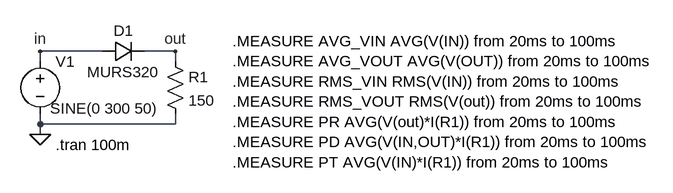
[diagram p0: schematic redressement simple.asc]
redressement simple.asc, the LTspice schematic file:
Version 4
SHEET 1 880 680
WIRE -80 160 -176 160
WIRE 32 160 -16 160
WIRE -176 176 -176 160
WIRE 32 176 32 160
WIRE -176 272 -176 256
WIRE 32 272 32 256
WIRE 32 272 -176 272
WIRE -176 288 -176 272
FLAG -176 288 0
FLAG -176 160 in
FLAG 32 160 out
SYMBOL voltage -176 160 R0
WINDOW 123 0 0 Left 0
WINDOW 39 0 0 Left 0
WINDOW 3 15 88 Left 0
SYMATTR InstName V1
SYMATTR Value SINE(0 300 50)
SYMBOL diode -80 176 R270
WINDOW 0 32 32 VTop 0
WINDOW 3 0 32 VBottom 0
SYMATTR InstName D1
SYMATTR Value MURS320
SYMBOL res 16 160 R0
SYMATTR InstName R1
SYMATTR Value 150
TEXT -152 304 Left 0 !.tran 100m
TEXT 120 144 Left 0 !.MEASURE AVG_VIN AVG(V(IN)) from 20ms to 100ms\n.MEASURE AVG_VOUT AVG(V(OUT)) from 20ms to 100ms\n.MEASURE RMS_VIN RMS(V(IN)) from 20ms to 100ms\n.MEASURE RMS_VOUT RMS(V(out)) from 20ms to 100ms\n.MEASURE PR AVG(V(out)*I(R1)) from 20ms to 100ms\n.MEASURE PD AVG(V(IN,OUT)*I(R1)) from 20ms to 100ms\n.MEASURE PT AVG(V(IN)*I(R1)) from 20ms to 100ms

The netlist it stands for:
* redressement simple.asc
V1 in 0 SINE(0 300 50)
D1 in out MURS320
R1 out 0 150
.model D D
.lib standard.dio
.tran 100m
.MEASURE AVG_VIN AVG(V(IN)) from 20ms to 100ms
.MEASURE AVG_VOUT AVG(V(OUT)) from 20ms to 100ms
.MEASURE RMS_VIN RMS(V(IN)) from 20ms to 100ms
.MEASURE RMS_VOUT RMS(V(out)) from 20ms to 100ms
.MEASURE PR AVG(V(out)*I(R1)) from 20ms to 100ms
.MEASURE PD AVG(V(IN,OUT)*I(R1)) from 20ms to 100ms
.MEASURE PT AVG(V(IN)*I(R1)) from 20ms to 100ms
.backanno
.end